# EAGLE design akabeacon_circle_da14580 (EAGLE 7.3.2)
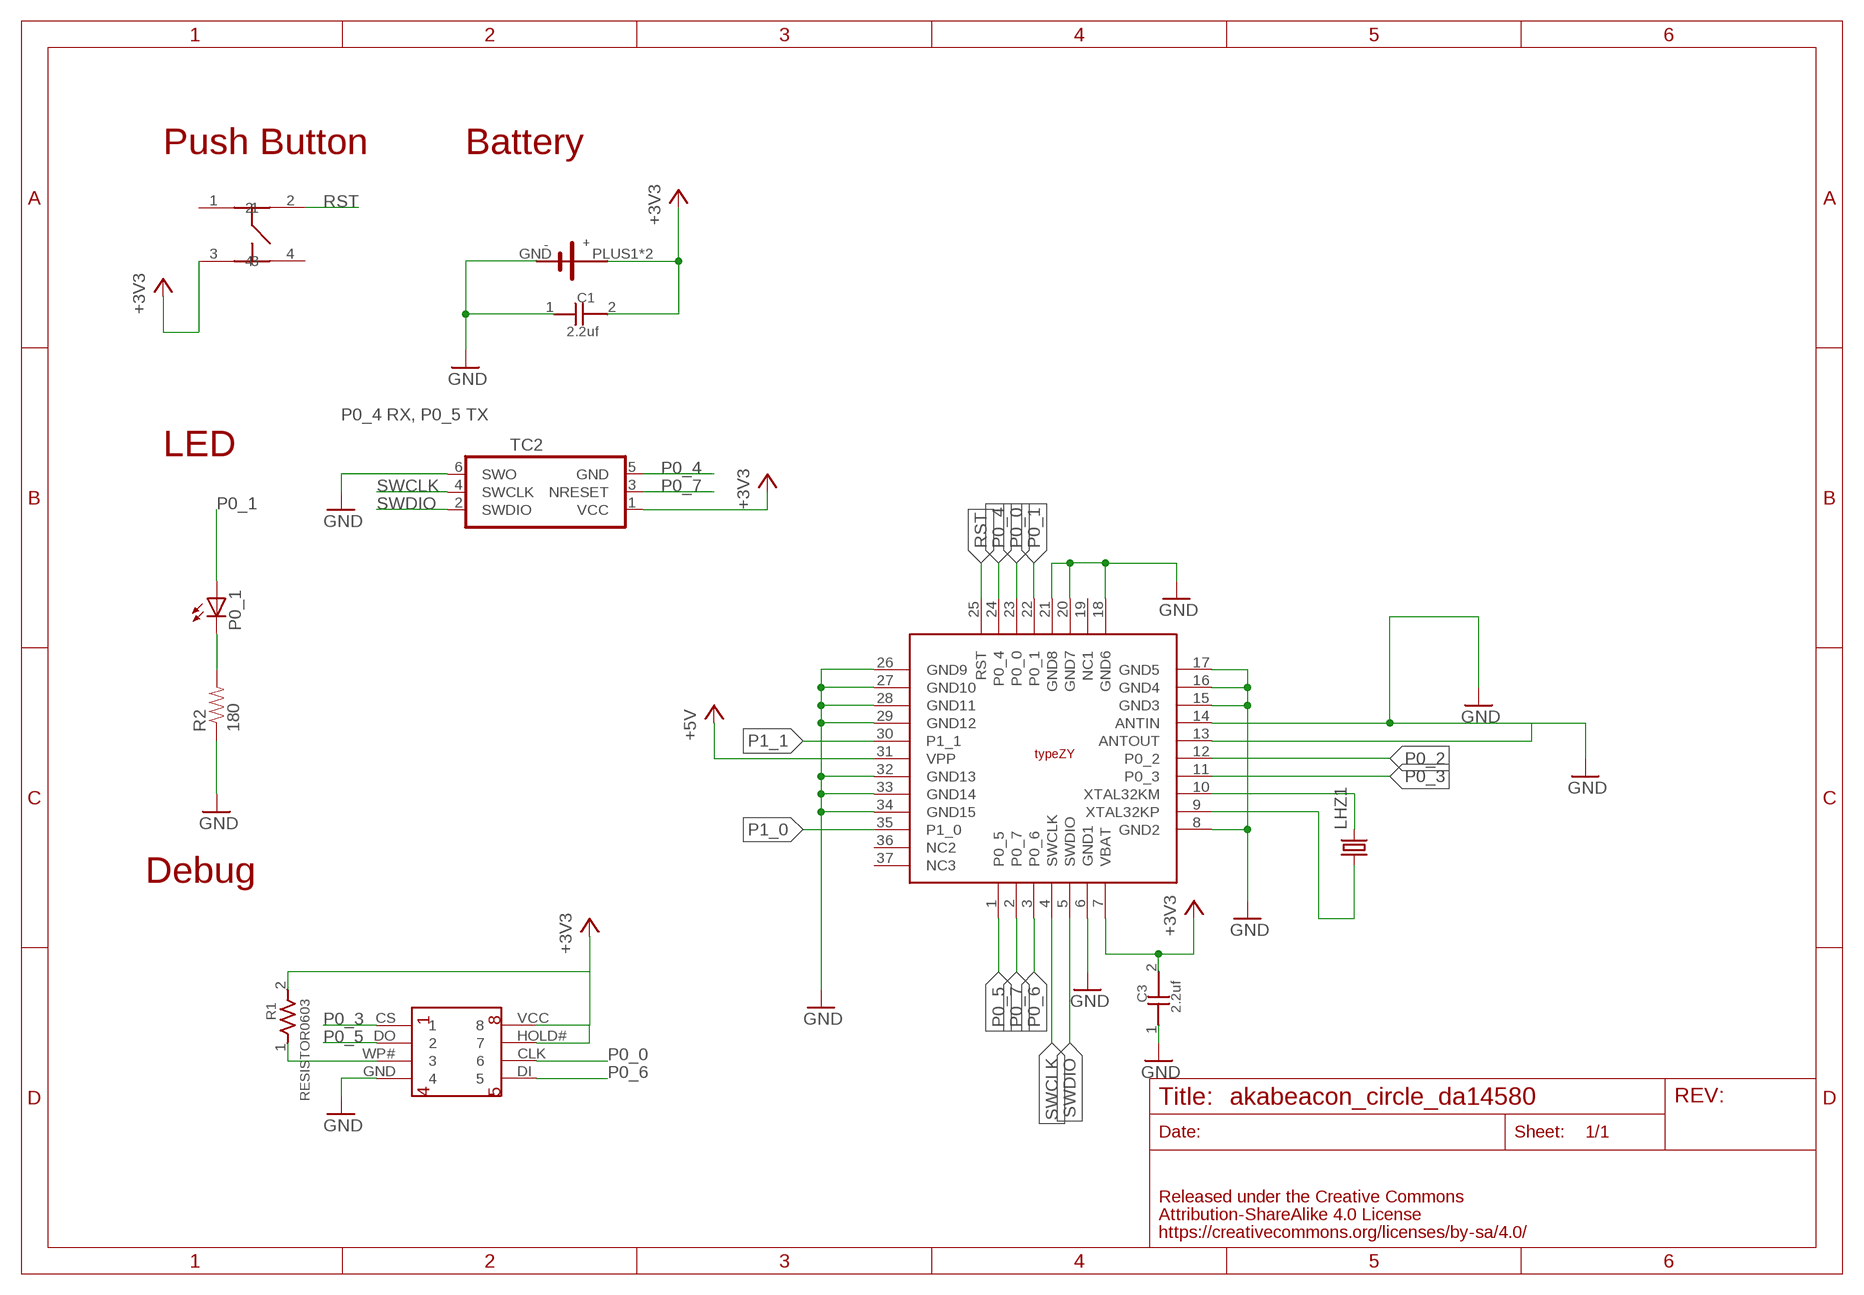
[diagram p0: schematic, sheet 1]

## Parts
C1  2.2uf  CAPACITOR0603  [0603]
C3  2.2uf  CAPACITOR0603  [0603]
LHZ1  FC-12M  [FC-12M]
P0_1  LEDCHIP-LED0603  [CHIP-LED0603]
R1  RESISTOR0603  [0603]
R2  180  RESISTOR0603-RES  [0603-RES]
TC2  TC2030-IDC-NL  [TC2030-IDC-NL]
U$1  MURATA-TYPEZY  [MURATA_TYPEZY]
U$3  CIRCLE-TYPE1  [CIRCLE-TYE1-TC2030]
U$5  FLASH-MEMORY-2M(WINBOND)  [FLASH-MEMORY-2M(WINBOND)]
U$7  SWICTH-4P(KMR2)  [SWITCH-4P(KMR2)]

## Nets
+3V3: C1.2 C3.2 R1.2 TC2.1(VCC) U$1.7(VBAT) U$3.PLUS1(VCC) U$3.PLUS2(VCC) U$5.HOLD# U$5.VCC U$7.3
+5V: U$1.31(VPP)
GND: C1.1 C3.1 R2.1 TC2.6(SWO) U$1.6(GND1) U$1.8(GND2) U$1.14(ANTIN) U$1.15(GND3) U$1.16(GND4) U$1.17(GND5) U$1.18(GND6) U$1.20(GND7) U$1.21(GND8) U$1.26(GND9) U$1.27(GND10) U$1.28(GND11) U$1.29(GND12) U$1.32(GND13) U$1.33(GND14) U$1.34(GND15) U$3.GND U$5.GND
LED1: P0_1.C R2.2
N$1: U$1.13(ANTOUT)
N$2: R1.1 U$5.WP#
P0_0: U$1.23(P0_0) U$5.CLK
P0_1: P0_1.A U$1.22(P0_1)
P0_2: U$1.12(P0_2)
P0_3: U$1.11(P0_3) U$5.CS
P0_4: TC2.5(GND) U$1.24(P0_4)
P0_5: U$1.1(P0_5) U$5.DO
P0_6: U$1.3(P0_6) U$5.DI
P0_7: TC2.3(NRESET) U$1.2(P0_7)
P1_0: U$1.35(P1_0)
P1_1: U$1.30(P1_1)
RST: U$1.25(RST) U$7.2
SWCLK: TC2.4(SWCLK) U$1.4(SWCLK)
SWDIO: TC2.2(SWDIO) U$1.5(SWDIO)
XTAL32KM: LHZ1.2 U$1.10(XTAL32KM)
XTAL32KP: LHZ1.1 U$1.9(XTAL32KP)
Unconnected: U$1.19(NC1) U$1.36(NC2) U$1.37(NC3) U$7.1 U$7.4

## Notes on the sheet
- Push Button | Battery
- P0_4 RX, P0_5 TX
- LED
- Debug

## Library data of the parts
C1 C3 = GClue-Capacitor:CAPACITOR
LHZ1 = crystal:FC-12M: kHz RANGE CRYSTAL UNIT LOW PROFILE SMD Source: Epson Toyocom FC-12M.pdf
P0_1 = led:LED: LED OSRAM: - CHIPLED LG R971, LG N971, LY N971, LG Q971, LY Q971, LO R971, LY R971 LH N974, LH R974 LS Q976, LO Q976, LY Q976 LO Q996 - Hyper CHIPLED LW Q18S LB Q993, LB Q99A, LB R99A - SideLED LS A670, LO A670, LY A670, LG A670, LP A670 LB A673, LV A673, LT A673, LW A673 LH A674 LY A675 LS A676, LA A676, LO A676, LY A676, LW A676 LS A679, LY A679, LG A679 - Hyper Micro SIDELED® LS Y876, LA Y876, LO Y876, LY Y876 LT Y87S - SmartLED LW L88C, LW L88S LB L89C, LB L89S, LG L890 LS L89K, LO L89K, LY L89K LS L896, LA L896, LO L896, LY L896 - TOPLED LS T670, LO T670, LY T670, LG T670, LP T670 LSG T670, LSP T670, LSY T670, LOP T670, LYG T670 LG T671, LOG T671, LSG T671 LB T673, LV T673, LT T673, LW T673 LH T674 LS T676, LA T676, LO T676, LY T676, LB T676, LH T676, LSB T676, LW T676 LB T67C, LV T67C, LT T67C, LS T67K, LO T67K, LY T67K, LW E67C LS E67B, LA E67B, LO E67B, LY E67B, LB E67C, LV E67C, LT E67C LW T67C LS T679, LY T679, LG T679 LS T770, LO T770, LY T770, LG T770, LP T770 LB T773, LV T773, LT T773, LW T773 LH T774 LS E675, LA E675, LY E675, LS T675 LS T776, LA T776, LO T776, LY T776, LB T776 LHGB T686 LT T68C, LB T68C - Hyper Mini TOPLED® LB M676 - Mini TOPLED Santana® LG M470 LS M47K, LO M47K, LY M47K Source: http://www.osram.convergy.de LUXEON: - LUMILED® LXK2-PW12-R00, LXK2-PW12-S00, LXK2-PW14-U00, LXK2-PW14-V00 LXK2-PM12-R00, LXK2-PM12-S00, LXK2-PM14-U00 LXK2-PE12-Q00, LXK2-PE12-R00, LXK2-PE12-S00, LXK2-PE14-T00, LXK2-PE14-U00 LXK2-PB12-K00, LXK2-PB12-L00, LXK2-PB12-M00, LXK2-PB14-N00, LXK2-PB14-P00, LXK2-PB14-Q00 LXK2-PR12-L00, LXK2-PR12-M00, LXK2-PR14-Q00, LXK2-PR14-R00 LXK2-PD12-Q00, LXK2-PD12-R00, LXK2-PD12-S00 LXK2-PH12-R00, LXK2-PH12-S00 LXK2-PL12-P00, LXK2-PL12-Q00, LXK2-PL12-R00 Source: www.luxeon.com KINGBRIGHT: KA-3528ASYC Source: www.kingbright.com
R1 = GClue-Resistors:RESISTOR
R2 = SparkFun:RESISTOR: Resistor Basic schematic elements and footprints for 0603, 1206, and PTH resistors.
TC2 = TagConnect:TC2030-IDC: Tag-Connect In Circuit Programming & Debug Cable 6 Pin http://www.tag-connect.com
U$1 = GClueBT:MURATA-TYPEZY
U$3 = GClue-Beacon:CIRCLE-TYPE1
U$5 = gclue:FLASH-MEMORY-2M(WINBOND)
U$7 = gclue-test:SWICTH-4P(KMR2)

## Board
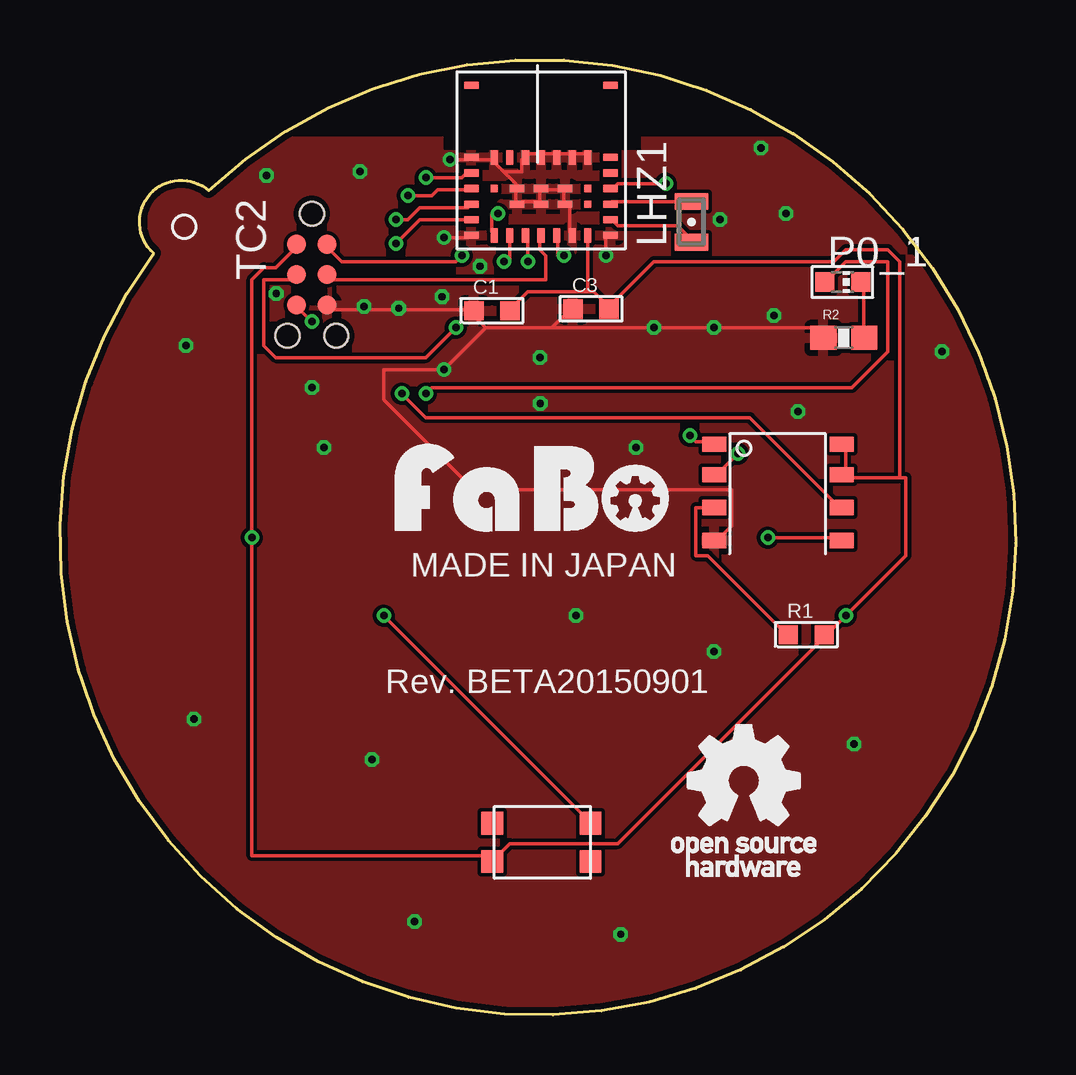
[diagram p1: board, top side]
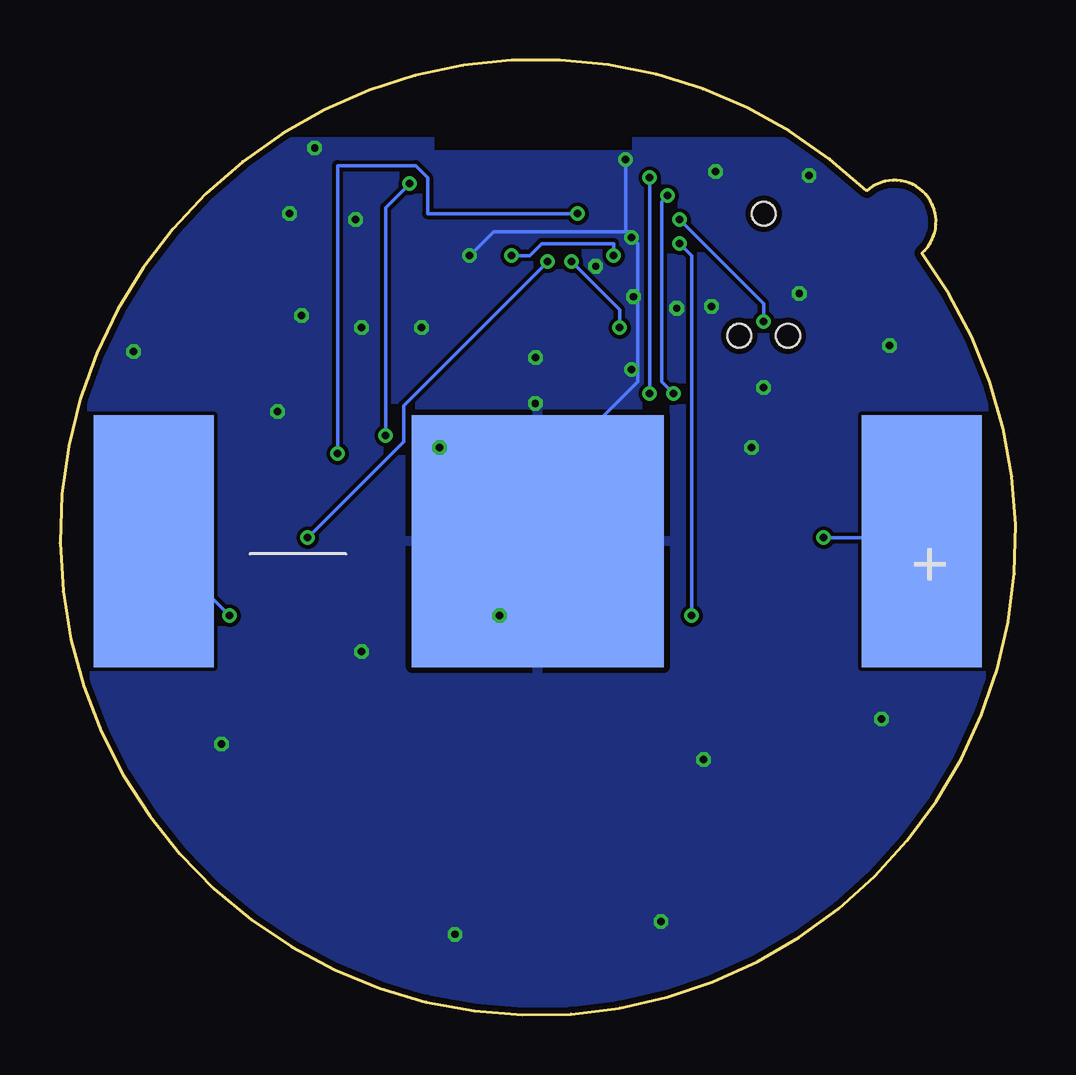
[diagram p2: board, bottom side, seen from below]

Size 39.81 x 39.79 mm. Coordinates in mm from the lower left corner, seen from the top.
Copper layers (1*16): Top 0.035mm / dielectric 1.5mm / Bottom 0.035mm
Design rules "SeeedStudio_2layer_DRU_no_angle_20140221": minimum track width 6mil, minimum drill 12mil, track to track 6mil, track to pad 6mil, pad to pad 6mil, via to via 6mil, smd to smd 0mil, copper to edge 10mil, drill to drill 10mil, minimum pad ring 10mil, minimum via ring 6mil, stop-mask expansion 2mil, vias tented up to drill 100mil, thermal gap 10mil
tRestrict: area 16,36 to 24.2,39.9
bRestrict: area 16,36 to 24.2,39.9

### Footprints (pad centres in the part's own frame; a part is rotated, then mirrored left to right if it is on the bottom)
0603 = smd 0.8 x 0.8: 1 -0.75,0; 2 0.75,0
FC-12M = smd 0.7 x 1.4: 1 -0.85,0; 2 0.85,0
CHIP-LED0603 = smd 0.8 x 0.8: A 0,-0.75; C 0,0.75
0603-RES = smd 1.1 x 1: 1 -0.85,0; 2 0.85,0
TC2030-IDC-NL = smd 0.787 x 0.787: 1 -1.27,-0.635; 2 -1.27,0.635; 3 0,-0.635; 4 0,0.635; 5 1.27,-0.635; 6 1.27,0.635 | hole 0.991: -2.54,0; 2.54,1.016; 2.54,-1.016
MURATA_TYPEZY = smd 0.3 x 0.6: 1 -1.95,-1.625; 2 -1.3,-1.625; 3 -0.65,-1.625; 4 0,-1.625; 5 0.65,-1.625; 6 1.3,-1.625; 7 1.95,-1.625; 14 1.95,1.625; 15 1.3,1.625; 16 0.65,1.625; 17 0,1.625; 18 -0.65,1.625; 19 -1.3,1.625; 20 -1.95,1.625 | smd 0.6 x 0.3: 8 2.9,-1.625; 9 2.9,-0.975; 10 2.9,-0.325; 11 2.9,0.325; 12 2.9,0.975; 13 2.9,1.625; 21 -2.9,1.625; 22 -2.9,0.975; 23 -2.9,0.325; 24 -2.9,-0.325; 25 -2.9,-0.975; 26 -2.9,-1.625; 27 -1,-0.325; 28 0,-0.325; 29 1,-0.325; 32 1,0.325; 33 0,0.325; 34 -1,0.325; 36 2.9,4.625; 37 -2.9,4.625 | smd 0.3 x 0.3: 30 1.95,-0.325; 31 1.95,0.325; 35 -1.95,0.325
CIRCLE-TYE1-TC2030 = smd 10.5 x 10.5 bottom: GND 0,0 | smd 5 x 10.5 bottom: PLUS1 -16,0; PLUS2 16,0
FLASH-MEMORY-2M(WINBOND) = smd 1 x 0.635: CLK 2.67,0.2; CS -2.64,2.84; DI 2.67,-1.17; DO -2.64,1.57; GND -2.64,-1.17; HOLD# 2.67,1.57; VCC 2.67,2.84; WP# -2.64,0.2
SWITCH-4P(KMR2) = smd 0.9 x 0.95: 1 -1,0; 2 3.1,0; 3 -1,-1.6; 4 3.1,-1.6

### Placement (x,y rotation side)
C1  18,29.34 0 top
C3  22.12,29.42 0 top
LHZ1  26.31,33.04 90 top
P0_1  32.61,30.54 270 top
R1  31.1,15.84 0 top
R2  32.66,28.22 0 top
TC2  10.5,30.84 270 top
U$1  20.04,34.11 0 top
U$2  [LOGO_FABO_M]  19.67,20.14 0 top
U$3  19.9,19.74 0 top
U$5  29.9,20.94 0 top
U$6  [LOGO_OSHW_T_M]  28.5,9.74 0 top
U$7  19.01,7.99 0 top

### Tracks (layer width: path | path; a pad name or v marks a point on that pad's centre or on a via)
+3V3  (via drill 0.3)
  Top 0.152: 22,30.14 22,32.39 U$1.7 | 22,30.14 22.25,30.14 22.75,29.64 C3.2 23,29.64 24.75,31.39 32.25,31.39 32.75,31.89 34.5,31.89 35,31.39 35,22.39 | 22,30.14 19.5,30.14 18.75,29.39 C1.2 | 35,22.39 32.75,22.39 U$5.HOLD# 32.75,22.64 32.75,23.64 U$5.VCC | 35,22.39 35.25,22.39 35.25,19.14 v32.75,16.64 32,15.89 R1.2 31.75,15.64 23.25,7.14 18.75,7.14 18.25,6.64 U$7.3 18,6.64 8,6.64 v8,19.89 8,30.64 8.5,31.14 9,31.14 9.75,31.89 TC2.1
  Bottom 0.152: v32.75,16.64 35.75,19.64 U$3.PLUS2 | v8,19.89 4,19.89 U$3.PLUS1
GND  (via drill 0.3)
  Top 0.152: TC2.6 11.25,29.39 17,29.39 C1.1 17.25,29.14 17.75,28.64 | 20.5,28.64 21.25,29.39 C3.1 | 17.75,28.64 20.5,28.64 | 17.75,28.64 v16,26.89 13.5,26.89 13.5,25.64 17.25,21.89 28,21.89 28,20.39 27.5,19.89 U$5.GND | 20.5,28.64 v24.75,28.64 v27.25,28.64 31.5,28.64 31.75,28.39 R2.1 | 20,35.89 19.5,35.89 U$1.18 19.25,35.64 19.25,35.14 18.5,35.14 | 21.25,35.89 20.75,35.89 | 21.25,35.89 22,35.89 U$1.14 | 21.25,35.89 U$1.15 | 20.75,35.89 20,35.89 | 20,35.89 U$1.17 | 20.75,35.89 U$1.16 | U$1.6 21.25,32.64 21.25,33.64 U$1.29 21,33.89 21,34.39 | 18,35.64 17.25,35.64 U$1.21 17,35.64 v16.25,35.64 | 20,33.89 20,34.39 U$1.33 20.25,34.39 21,34.39 | 20,33.89 19.25,33.89 U$1.27 19,33.89 19,34.39 U$1.34 19.25,34.39 18.5,35.14 | 20,33.89 U$1.28 | 18.5,35.14 18,35.64 | 18,35.64 U$1.20 | 21,34.39 U$1.32 | v16,32.39 17,32.39 U$1.26 | v22.75,31.64 22.75,32.39 U$1.8
  Bottom 0.152: 15.75,26.89 15.75,26.39 19.75,22.39 19.75,19.89 U$3.GND | 15.75,26.89 15.75,32.14 v16,32.39 16,32.64 16.25,32.64 | v22.75,31.64 21.75,32.64 16.25,32.64 | 16.25,32.64 v16.25,35.64 | 15.75,26.89 v16,26.89
  other vias: 5.25,27.89 11,23.64 12.5,35.14 30.25,33.39 29.75,29.14 20,27.39 10.5,26.14 36.75,27.64 27.25,15.14 21.5,16.64 13,10.64 14.12,29.45 27.5,33.14 29.2,36.13 8.6,34.98 9.01,30.06 12.67,29.52 20.01,25.48 15.92,29.93 17.49,31.2 5.58,12.33 14.78,3.89 23.36,3.36 33.09,11.28 24,23.64 30.75,25.14
  pour Top: -4.5,-0.86 40.5,-0.86 40.5,36.39 -4.5,36.39
  pour Bottom: -4.5,-0.86 40.5,-0.86 40.5,36.39 -4.5,36.39
LED1
  Top 0.152: P0_1.C 33.5,30.39 33.5,28.39 R2.2
N$2
  Top 0.152: U$5.WP# 26.5,21.14 26.5,19.14 27,19.14 30.25,15.89 R1.1
P0_0  (via drill 0.3)
  Top 0.152: v14.5,34.14 15.5,34.14 15.75,34.39 17,34.39 U$1.23 | v14.25,25.89 15.25,24.89 28.75,24.89 32.5,21.14 U$5.CLK
  Bottom 0.152: v14.5,34.14 14.75,33.89 14.75,26.39 v14.25,25.89
P0_1  (via drill 0.3)
  Top 0.152: v15.25,34.89 16.75,34.89 17,35.14 U$1.22 | v15.25,25.89 15.5,26.14 33,26.14 34.5,27.64 34.5,31.39 32.75,31.39 32,30.64 P0_1.A
  Bottom 0.152: v15.25,25.89 v15.25,34.89
P0_3  (via drill 0.3)
  Top 0.152: v25.25,34.64 23.25,34.64 23,34.39 U$1.11 | v26.25,24.14 26.5,23.89 27.25,23.89 U$5.CS
  Bottom 0.152: v25.25,34.64 26.25,33.64 v26.25,24.14
P0_4  (via drill 0.3)
  Top 0.152: v14,33.14 14.5,33.14 15,33.64 17,33.64 U$1.24 | v10.5,28.89 10,29.39 TC2.5
  Bottom 0.152: v14,33.14 10.5,29.64 v10.5,28.89
P0_5  (via drill 0.3)
  Top 0.152: v18.25,33.39 18,33.39 18,32.64 U$1.1 | v28.25,23.39 27.5,22.64 U$5.DO
  Bottom 0.152: v18.25,33.39 24.5,33.39 24.5,34.89 25,35.39 28.25,35.39 v28.25,23.39
P0_6  (via drill 0.3)
  Top 0.152: v19.5,31.39 19.5,32.39 U$1.3 | v29.5,19.89 32.5,19.89 U$5.DI
  Bottom 0.152: v19.5,31.39 25.5,25.39 25.5,23.89 v29.5,19.89
P0_7  (via drill 0.3)
  Top 0.152: v18.5,31.39 18.75,31.39 18.75,32.39 U$1.2 | v16.5,28.64 15.25,27.39 9,27.39 8.5,27.89 8.5,30.64 9.75,30.64 TC2.3
  Bottom 0.152: v18.5,31.39 16.5,29.39 v16.5,28.64
RST  (via drill 0.3)
  Top 0.152: v14,32.14 15,33.14 17,33.14 U$1.25 | v13.5,16.64 22,8.14 U$7.2
  Bottom 0.152: v14,32.14 13.5,31.64 v13.5,16.64
SWCLK
  Top 0.152: U$1.4 20,32.39 20,31.89 20.25,31.64 20.25,30.64 11.25,30.64 TC2.4
SWDIO  (via drill 0.3)
  Top 0.152: v21,31.64 20.75,31.64 20.75,32.39 U$1.5 | v16.75,31.64 16.5,31.39 11.75,31.39 11.25,31.89 TC2.2
  Bottom 0.152: v21,31.64 20.25,31.64 19.75,32.14 16.75,32.14 v16.75,31.64
XTAL32KM
  Top 0.152: U$1.10 23,33.89 26.25,33.89 LHZ1.2
XTAL32KP
  Top 0.152: U$1.9 23,33.14 23.25,32.89 25.75,32.89 26.25,32.39 LHZ1.1

### Text on the board
tPlace: MADE IN JAPAN | Rev. BETA20150901
bPlace: +